# EAGLE schematic version1_1 (EAGLE 6.1)
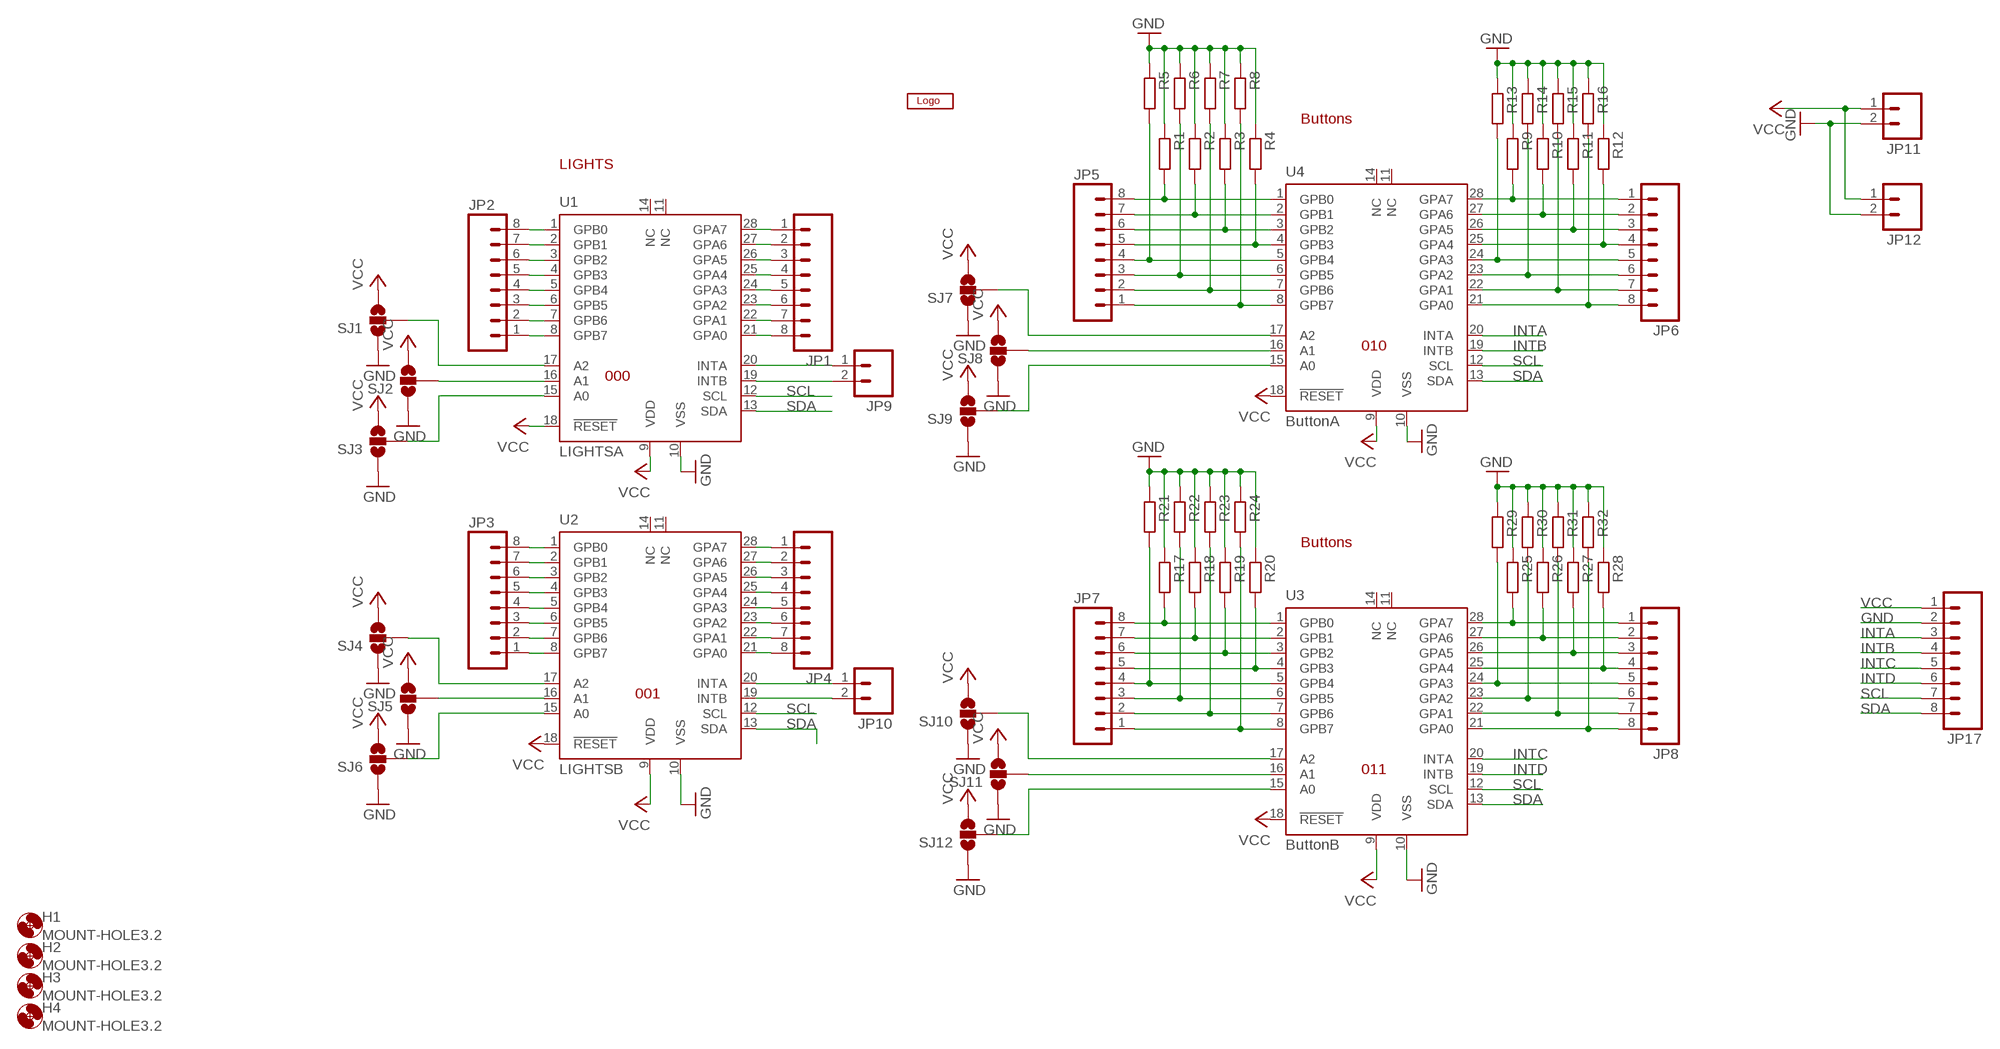
[diagram p0: schematic, sheet 1]

## Parts
H1  MOUNT-HOLE3.2  [3,2]
H2  MOUNT-HOLE3.2  [3,2]
H3  MOUNT-HOLE3.2  [3,2]
H4  MOUNT-HOLE3.2  [3,2]
JP1  M08LOCK  [1X08_LOCK]
JP2  M08LOCK  [1X08_LOCK]
JP3  M08LOCK  [1X08_LOCK]
JP4  M08LOCK  [1X08_LOCK]
JP5  M08LOCK  [1X08_LOCK]
JP6  M08LOCK  [1X08_LOCK]
JP7  M08LOCK  [1X08_LOCK]
JP8  M08LOCK  [1X08_LOCK]
JP9  M021X02_NO_SILK  [1X02_NO_SILK]
JP10  M021X02_NO_SILK  [1X02_NO_SILK]
JP11  M021X02_NO_SILK  [1X02_NO_SILK]
JP12  M021X02_NO_SILK  [1X02_NO_SILK]
JP17  M08LOCK  [1X08_LOCK]
R1  R-EU_R0805  [R0805]
R2  R-EU_R0805  [R0805]
R3  R-EU_R0805  [R0805]
R4  R-EU_R0805  [R0805]
R5  R-EU_R0805  [R0805]
R6  R-EU_R0805  [R0805]
R7  R-EU_R0805  [R0805]
R8  R-EU_R0805  [R0805]
R9  R-EU_R0805  [R0805]
R10  R-EU_R0805  [R0805]
R11  R-EU_R0805  [R0805]
R12  R-EU_R0805  [R0805]
R13  R-EU_R0805  [R0805]
R14  R-EU_R0805  [R0805]
R15  R-EU_R0805  [R0805]
R16  R-EU_R0805  [R0805]
R17  R-EU_R0805  [R0805]
R18  R-EU_R0805  [R0805]
R19  R-EU_R0805  [R0805]
R20  R-EU_R0805  [R0805]
R21  R-EU_R0805  [R0805]
R22  R-EU_R0805  [R0805]
R23  R-EU_R0805  [R0805]
R24  R-EU_R0805  [R0805]
R25  R-EU_R0805  [R0805]
R26  R-EU_R0805  [R0805]
R27  R-EU_R0805  [R0805]
R28  R-EU_R0805  [R0805]
R29  R-EU_R0805  [R0805]
R30  R-EU_R0805  [R0805]
R31  R-EU_R0805  [R0805]
R32  R-EU_R0805  [R0805]
SJ1  SOLDERJUMPER_2WAY-OLDS  [SJ_3]
SJ2  SOLDERJUMPER_2WAY-OLDS  [SJ_3]
SJ3  SOLDERJUMPER_2WAY-OLDS  [SJ_3]
SJ4  SOLDERJUMPER_2WAY-OLDS  [SJ_3]
SJ5  SOLDERJUMPER_2WAY-OLDS  [SJ_3]
SJ6  SOLDERJUMPER_2WAY-OLDS  [SJ_3]
SJ7  SOLDERJUMPER_2WAY-OLDS  [SJ_3]
SJ8  SOLDERJUMPER_2WAY-OLDS  [SJ_3]
SJ9  SOLDERJUMPER_2WAY-OLDS  [SJ_3]
SJ10  SOLDERJUMPER_2WAY-OLDS  [SJ_3]
SJ11  SOLDERJUMPER_2WAY-OLDS  [SJ_3]
SJ12  SOLDERJUMPER_2WAY-OLDS  [SJ_3]
U1  LIGHTSA  MCP23017A  [MCP23017A]
U2  LIGHTSB  MCP23017A  [MCP23017A]
U3  ButtonB  MCP23017A  [MCP23017A]
U4  ButtonA  MCP23017A  [MCP23017A]
U$1  BUNNYLOGOCALVIN2  [CALVIN2]

## Nets
GND [power]: JP11.2 JP12.2 JP17.2 R1.1 R2.1 R3.1 R4.1 R5.1 R6.1 R7.1 R8.1 R9.1 R10.1 R11.1 R12.1 R13.1 R14.1 R15.1 R16.1 R17.1 R18.1 R19.1 R20.1 R21.1 R22.1 R23.1 R24.1 R25.1 R26.1 R27.1 R28.1 R29.1 R30.1 R31.1 R32.1 SJ1.1 SJ2.1 SJ3.1 SJ4.1 SJ5.1 SJ6.1 SJ7.1 SJ8.1 SJ9.1 SJ10.1 SJ11.1 SJ12.1 U1.10(VSS) U2.10(VSS) U3.10(VSS) U4.10(VSS)
INTA: JP17.3 U4.20(INTA)
INTB: JP17.4 U4.19(INTB)
INTC: JP17.5 U3.20(INTA)
INTD: JP17.6 U3.19(INTB)
N$1: JP1.1 U1.28(GPA7)
N$2: JP1.2 U1.27(GPA6)
N$3: JP1.3 U1.26(GPA5)
N$4: JP1.4 U1.25(GPA4)
N$5: JP1.5 U1.24(GPA3)
N$6: JP1.6 U1.23(GPA2)
N$7: JP1.7 U1.22(GPA1)
N$8: JP1.8 U1.21(GPA0)
N$9: JP2.1 U1.8(GPB7)
N$10: JP2.2 U1.7(GPB6)
N$11: JP2.3 U1.6(GPB5)
N$12: JP2.4 U1.5(GPB4)
N$13: JP2.5 U1.4(GPB3)
N$14: JP2.6 U1.3(GPB2)
N$15: JP2.7 U1.2(GPB1)
N$16: JP2.8 U1.1(GPB0)
N$17: JP3.1 U2.8(GPB7)
N$18: JP3.2 U2.7(GPB6)
N$19: JP3.3 U2.6(GPB5)
N$20: JP3.4 U2.5(GPB4)
N$21: JP3.5 U2.4(GPB3)
N$22: JP3.6 U2.3(GPB2)
N$23: JP3.7 U2.2(GPB1)
N$24: JP3.8 U2.1(GPB0)
N$25: JP4.1 U2.28(GPA7)
N$26: JP4.2 U2.27(GPA6)
N$27: JP4.3 U2.26(GPA5)
N$28: JP4.4 U2.25(GPA4)
N$29: JP4.5 U2.24(GPA3)
N$30: JP4.6 U2.23(GPA2)
N$31: JP4.7 U2.22(GPA1)
N$32: JP4.8 U2.21(GPA0)
N$33: JP5.1 R8.2 U4.8(GPB7)
N$34: JP5.2 R7.2 U4.7(GPB6)
N$35: JP5.3 R6.2 U4.6(GPB5)
N$36: JP5.4 R5.2 U4.5(GPB4)
N$37: JP5.5 R4.2 U4.4(GPB3)
N$38: JP5.6 R3.2 U4.3(GPB2)
N$39: JP5.7 R2.2 U4.2(GPB1)
N$40: JP5.8 R1.2 U4.1(GPB0)
N$41: JP6.1 R9.2 U4.28(GPA7)
N$42: JP6.2 R10.2 U4.27(GPA6)
N$43: JP6.3 R11.2 U4.26(GPA5)
N$44: JP6.4 R12.2 U4.25(GPA4)
N$45: JP6.5 R13.2 U4.24(GPA3)
N$46: JP6.6 R14.2 U4.23(GPA2)
N$47: JP6.7 R15.2 U4.22(GPA1)
N$48: JP6.8 R16.2 U4.21(GPA0)
N$49: JP7.1 R24.2 U3.8(GPB7)
N$50: JP7.2 R23.2 U3.7(GPB6)
N$51: JP7.3 R22.2 U3.6(GPB5)
N$52: JP7.4 R21.2 U3.5(GPB4)
N$53: JP7.5 R20.2 U3.4(GPB3)
N$54: JP7.6 R19.2 U3.3(GPB2)
N$55: JP7.7 R18.2 U3.2(GPB1)
N$56: JP7.8 R17.2 U3.1(GPB0)
N$57: JP8.1 R25.2 U3.28(GPA7)
N$58: JP8.2 R26.2 U3.27(GPA6)
N$59: JP8.3 R27.2 U3.26(GPA5)
N$60: JP8.4 R28.2 U3.25(GPA4)
N$61: JP8.5 R29.2 U3.24(GPA3)
N$62: JP8.6 R30.2 U3.23(GPA2)
N$63: JP8.7 R31.2 U3.22(GPA1)
N$64: JP8.8 R32.2 U3.21(GPA0)
N$67: JP10.1 U2.20(INTA)
N$68: JP10.2 U2.19(INTB)
N$69: JP9.1 U1.20(INTA)
N$70: JP9.2 U1.19(INTB)
N$71: SJ4.2 U2.17(A2)
N$72: SJ5.2 U2.16(A1)
N$73: SJ6.2 U2.15(A0)
N$74: SJ10.2 U3.17(A2)
N$75: SJ11.2 U3.16(A1)
N$76: SJ12.2 U3.15(A0)
N$77: SJ2.2 U1.16(A1)
N$78: SJ3.2 U1.15(A0)
N$79: SJ1.2 U1.17(A2)
N$80: SJ7.2 U4.17(A2)
N$81: SJ8.2 U4.16(A1)
N$82: SJ9.2 U4.15(A0)
SCL: JP17.7 U1.12(SCL) U2.12(SCL) U3.12(SCL) U4.12(SCL)
SDA: JP17.8 U1.13(SDA) U2.13(SDA) U3.13(SDA) U4.13(SDA)
VCC [power]: JP11.1 JP12.1 JP17.1 SJ1.3 SJ2.3 SJ3.3 SJ4.3 SJ5.3 SJ6.3 SJ7.3 SJ8.3 SJ9.3 SJ10.3 SJ11.3 SJ12.3 U1.9(VDD) U1.18(!RESET) U2.9(VDD) U2.18(!RESET) U3.9(VDD) U3.18(!RESET) U4.9(VDD) U4.18(!RESET)
Unconnected: U1.11(NC) U1.14(NC) U2.11(NC) U2.14(NC) U3.11(NC) U3.14(NC) U4.11(NC) U4.14(NC)

## Notes on the sheet
- Buttons
- LIGHTS
- 010
- 000
- Buttons
- 001
- 011

## Library data of the parts
H1-H4 = holes:MOUNT-HOLE: MOUNTING HOLE with drill center marker
JP1-JP8 JP17 = SparkFun:M08: Header 8 Standard 8-pin 0.1" header. Use with straight break away headers (SKU : PRT-00116), right angle break away headers (PRT-00553), swiss pins (PRT-00743), machine pins (PRT-00117), and female headers (PRT-00115).
JP9-JP12 = SparkFun:M02: Header 2 Standard 2-pin 0.1" header. Use with straight break away headers (SKU : PRT-00116), right angle break away headers (PRT-00553), swiss pins (PRT-00743), machine pins (PRT-00117), and female headers (PRT-00115). Molex polarized connector foot print use with SKU : PRT-08233 with associated crimp pins and housings.
R1-R32 = rcl:R-EU_: RESISTOR, European symbol
SJ1-SJ12 = SparkFun:SOLDERJUMPER_2WAY-OLD: Solder Jumper 2 way solder jumper
U1-U4 = brv_v6_2:MCP23017A: edit this description Auto generated by make-symbol-device-package-bsdl.ulp Rev. 43 Source:
U$1 = brv_v6_2:BUNNYLOGO

## Net classes
0 default: width 0.203 mm, drill 0.305 mm, clearance 0.203 mm
1 power: width 0.203 mm, drill 0.305 mm, clearance 0.203 mm